# Altium schematic sheet bob_breakout-bob.SchDoc
size A4; SheetNumber: 2; SheetTotal: 2
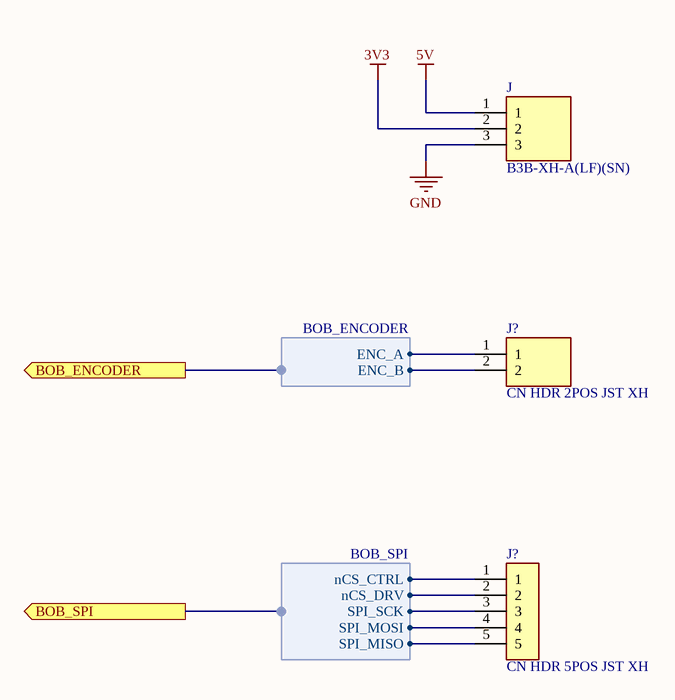
[diagram p0: bob_breakout-bob.SchDoc]

## Parts
(Parts that share a designator on the sheet are numbered #1, #2 ... from top to bottom, then left to right.)
J  B3B-XH-A(LF)(SN)  [JST_B3B-XH-A(LF)(SN)]
J?#1  CN HDR 2POS JST XH  [JST_B2B-XH-A(LF)(SN)]
J?#2  CN HDR 5POS JST XH  [JST_B5B-XH-A(LF)(SN)]

## Ports
BOB_ENCODER (out), BOB_SPI (out)

## Harnesses
BOB_ENCODER: ENC_A, ENC_B
BOB_SPI: nCS_CTRL, nCS_DRV, SPI_SCK, SPI_MOSI, SPI_MISO

## Nets
3V3: J.2
5V: J.1
GND: J.3
NetJ?#1_1: J?#1.1 ; harness BOB_ENCODER.ENC_A
NetJ?#1_2: J?#1.2 ; harness BOB_ENCODER.ENC_B
NetJ?#2_1: J?#2.1 ; harness BOB_SPI.nCS_CTRL
NetJ?#2_2: J?#2.2 ; harness BOB_SPI.nCS_DRV
NetJ?#2_3: J?#2.3 ; harness BOB_SPI.SPI_SCK
NetJ?#2_4: J?#2.4 ; harness BOB_SPI.SPI_MOSI
NetJ?#2_5: J?#2.5 ; harness BOB_SPI.SPI_MISO

## Library data of the parts
J = CN 3POS TH JSTXH: CN 3POS TH JST XH; MF: JST Sales; Package: None; SnapEDA_Link: https://www.snapeda.com/parts/B3B-XH-A(LF)(SN)/JST%20Sales%20America%20Inc./view-part/231271/?ref=snap; DigiKey-Purchase-URL: https://snapeda.com/shop?store=DigiKey&id=231271; MP: B3B-XH-A(LF)(SN); Price: None; Availability: Warning; Value: *
J?#1 = CN HDR 2POS JST XH: Connector Header Through Hole 2 position 0.098 _2.50mm_ / JST XH; MP: B2B-XH-A_LF__SN_; MF: JST Sales; Price: None; Package: None; Value: *; Availability: Unavailable; SnapEDA_Link: https://www.snapeda.com/parts/B2B-XH-A%28LF%29%28SN%29/JST%20Sales%20America%20Inc./view-part/492310/?ref=snap
J?#2 = CN HDR 5POS JST XH: Connector Header Through Hole 5 position 0.098" (2.50mm); MP: B5B-XH-A(LF)(SN); MF: JST Sales; Price: None; Package: None; Value: *; Availability: Unavailable; Digikey: 455-2270-ND; ComponentLink1Description: Digikey; ComponentLink1URL: https://www.digikey.ca/en/products/detail/jst-sales-america-inc/B5B-XH-A-LF-SN/1530483